# EAGLE schematic switch_mirrored_alu (EAGLE 9.6.2)
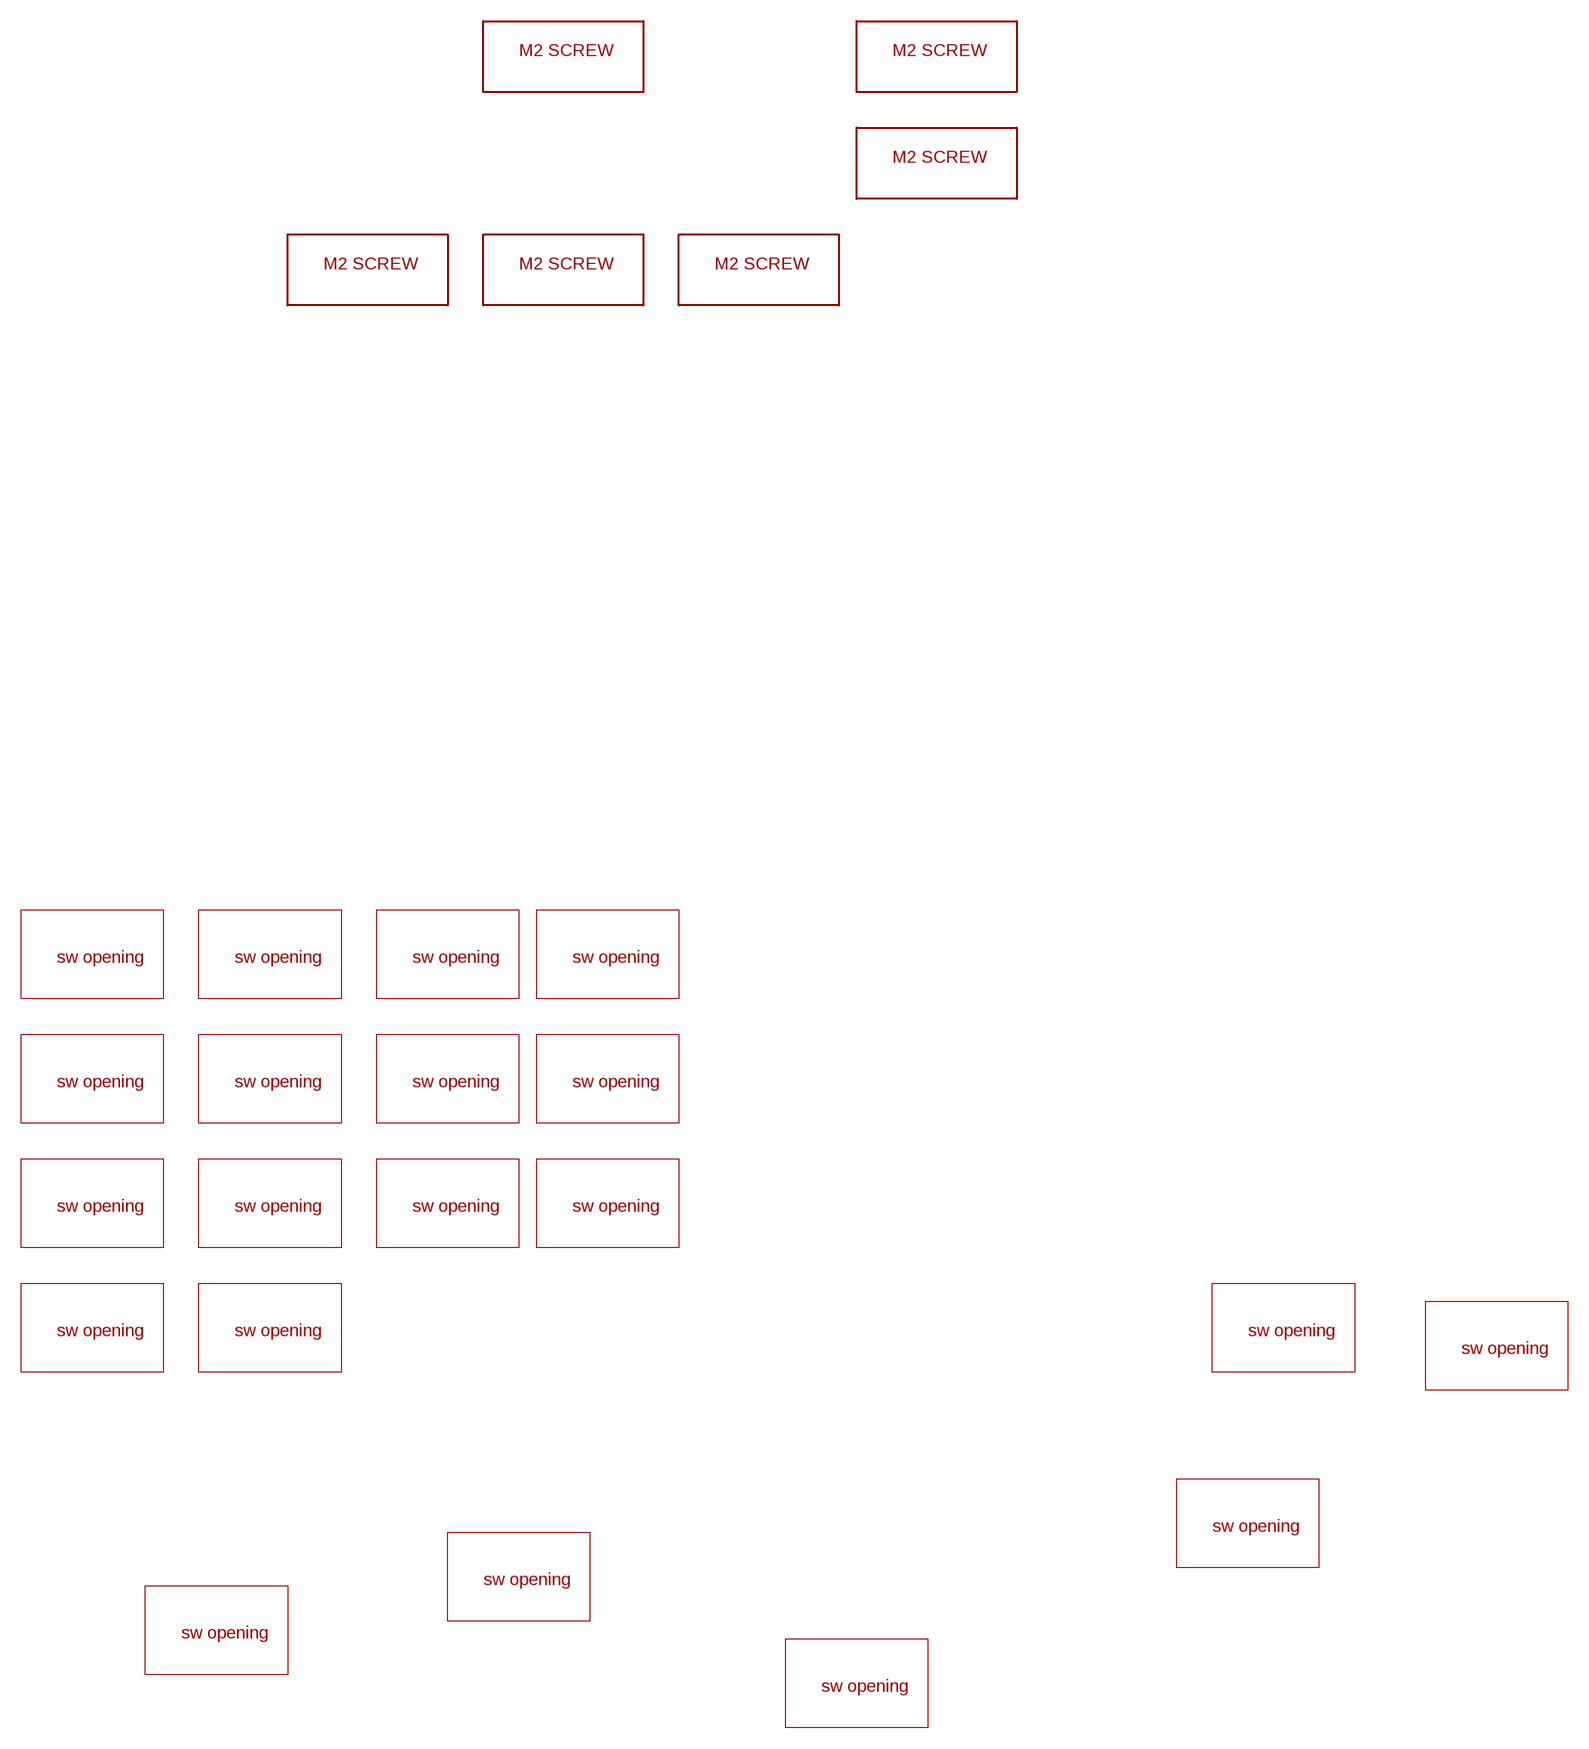
[diagram p0: schematic, sheet 1]

## Parts
U$1  SW_OPENM  [SW_OPENING]
U$2  SW_OPENM  [SW_OPENING]
U$3  SW_OPENM  [SW_OPENING]
U$4  SW_OPENM  [SW_OPENING]
U$5  SW_OPENM  [SW_OPENING]
U$6  SW_OPENM  [SW_OPENING]
U$7  SW_OPENM  [SW_OPENING]
U$8  M2_SCREW_DEV  [M2_SCREW_FOOT]
U$9  M2_SCREW_DEV  [M2_SCREW_FOOT]
U$10  SW_OPENM  [SW_OPENING]
U$11  SW_OPENM  [SW_OPENING]
U$12  M2_SCREW_DEV  [M2_SCREW_FOOT]
U$13  M2_SCREW_DEV  [M2_SCREW_FOOT]
U$14  M2_SCREW_DEV  [M2_SCREW_FOOT]
U$15  SW_OPENM  [SW_OPENING]
U$16  SW_OPENM  [SW_OPENING]
U$18  SW_OPENM  [SW_OPENING]
U$19  SW_OPENM  [SW_OPENING]
U$20  SW_OPENM  [SW_OPENING]
U$21  SW_OPENM  [SW_OPENING]
U$22  M2_SCREW_DEV  [M2_SCREW_FOOT]
U$23  SW_OPENM  [SW_OPENING]
U$24  SW_OPENM  [SW_OPENING]
U$25  SW_OPENM  [SW_OPENING]
U$26  SW_OPENM  [SW_OPENING]
U$27  SW_OPENM  [SW_OPENING]

## Library data of the parts
U$1-U$7 U$10 U$11 U$15 U$16 U$18-U$21 U$23-U$27 = duckypad:SW_OPENM
U$8 U$9 U$12-U$14 U$22 = duckypad:M2_SCREW_DEV